# Altium schematic sheet 01_Structure.SchDoc: Board Structure Illustration
size 381 x 266 mm; Organization: Meteroi; Address1: Room 428, 410 Guiping Rd.; Address2: Shanghai 200233, CHINA; SheetNumber: 1; SheetTotal: 9; PageSetup: Record=PageOptions|CenterHorizontal=True|CenterVertical=True|PrintScale=0.75|XCorrection=1.00|YCorrection=1.00|PrintKind=2|BorderSize=5000000|LeftOffset=0|BottomOffset=0|Orientation=2|PaperLength=1000|PaperWidth=1000|Scale=100|PaperSource=276|PrintQuality=-3|MediaType=1|DitherType=10|PaperKind=A4|PrintScaleMode=1
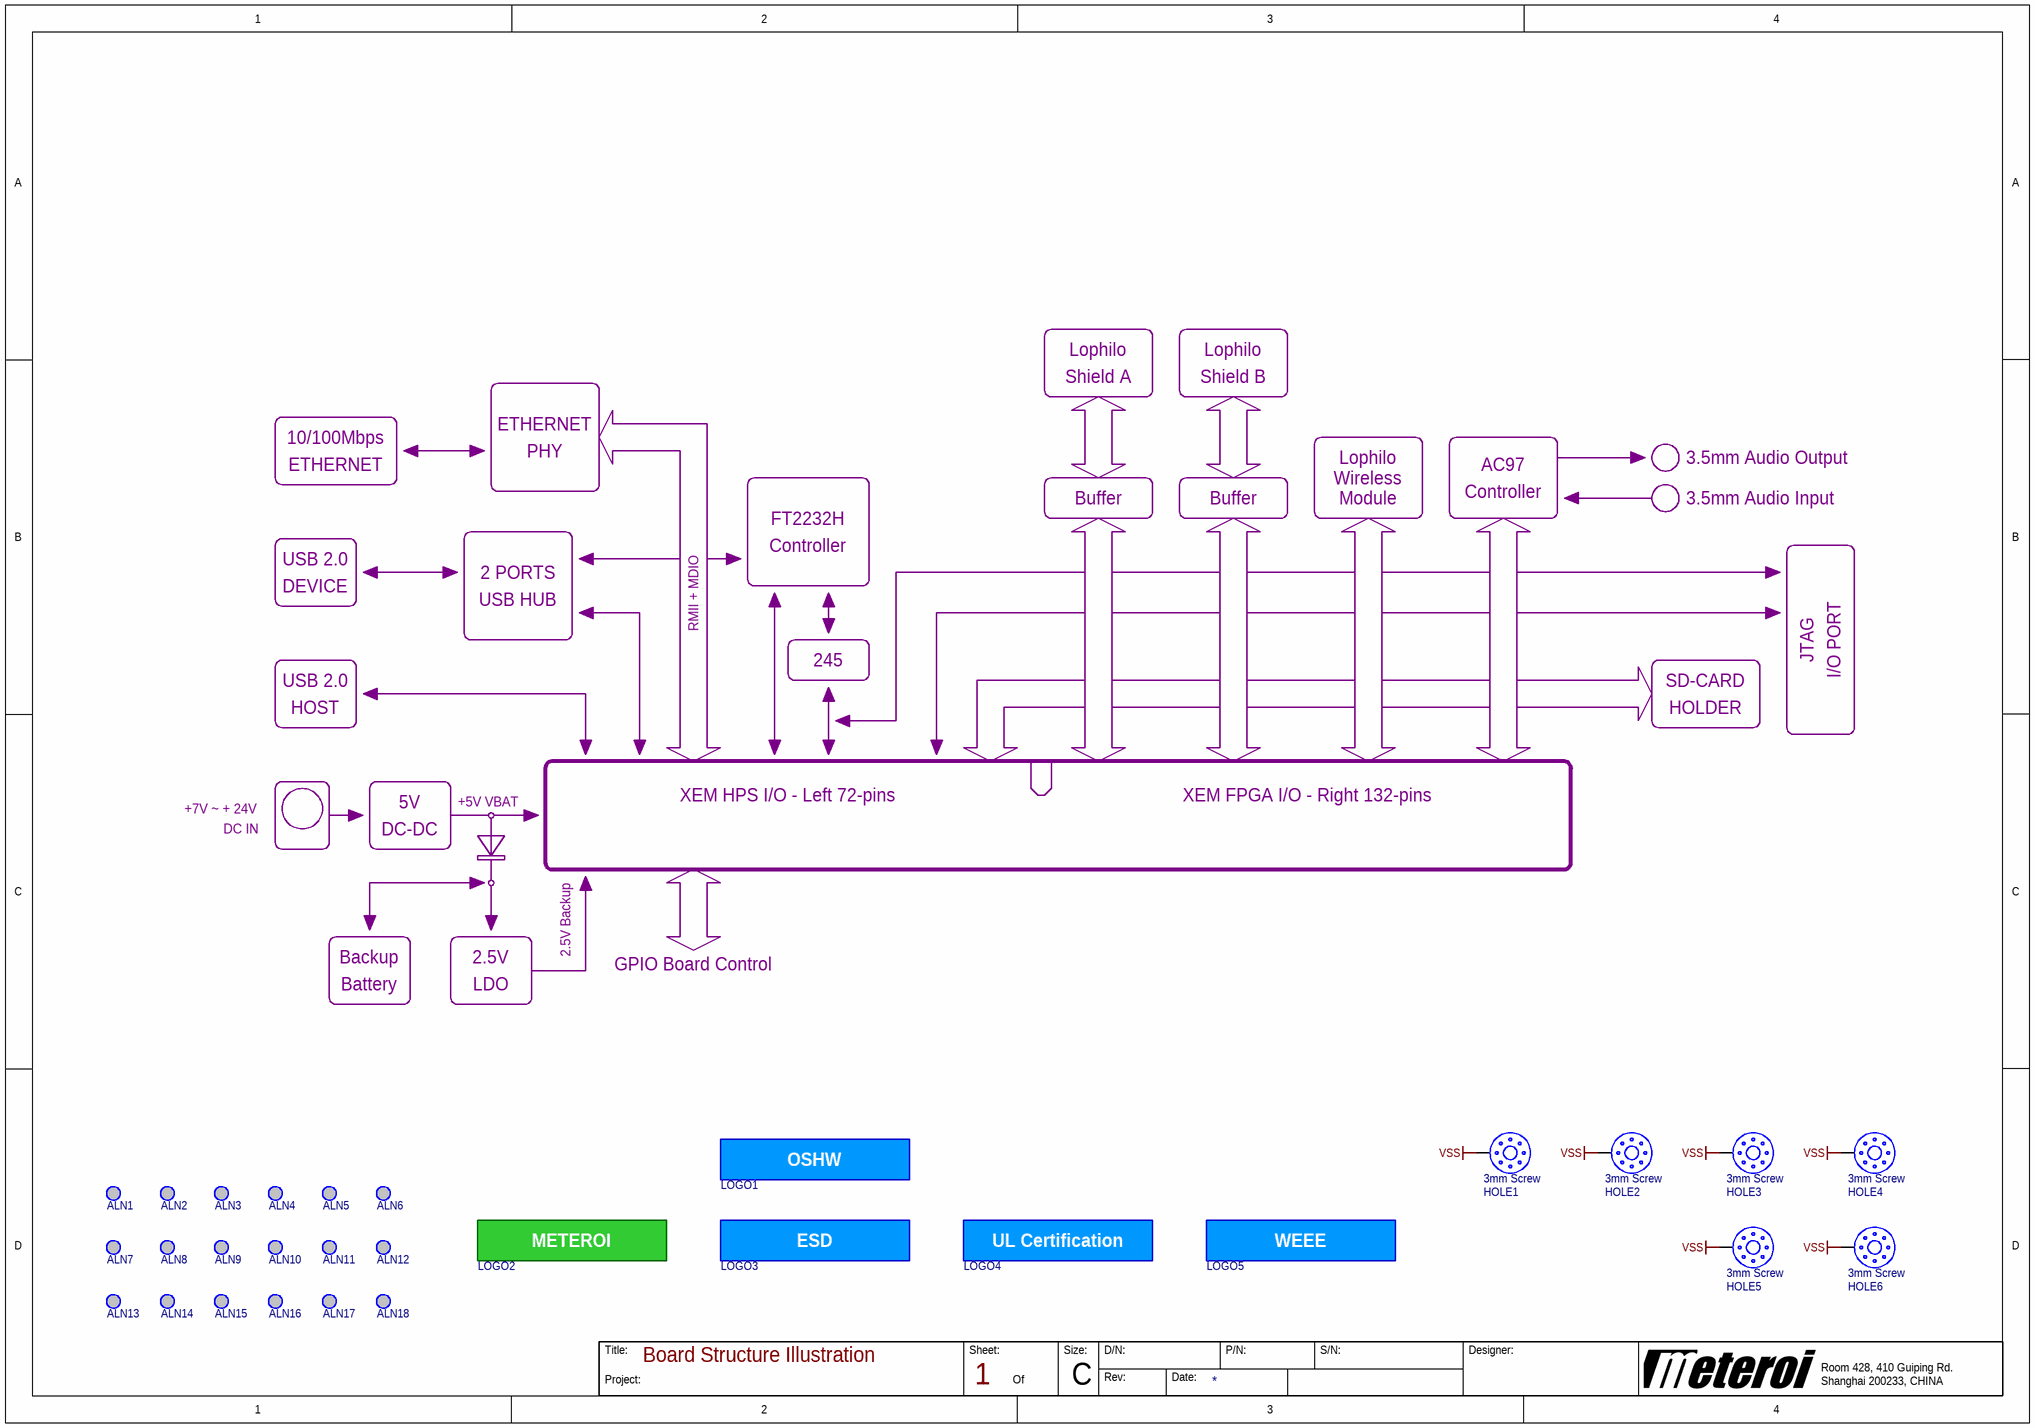
[diagram p0: 01_Structure.SchDoc]

## Parts
ALN1  Assembly Optical Align  [ALIGN_1]  (value not drawn)
ALN2  Assembly Optical Align  [ALIGN_1]  (value not drawn)
ALN3  Assembly Optical Align  [ALIGN_1]  (value not drawn)
ALN4  Assembly Optical Align  [ALIGN_1]  (value not drawn)
ALN5  Assembly Optical Align  [ALIGN_1]  (value not drawn)
ALN6  Assembly Optical Align  [ALIGN_1]  (value not drawn)
ALN7  Assembly Optical Align  [ALIGN_1]  (value not drawn)
ALN8  Assembly Optical Align  [ALIGN_1]  (value not drawn)
ALN9  Assembly Optical Align  [ALIGN_1]  (value not drawn)
ALN10  Assembly Optical Align  [ALIGN_1]  (value not drawn)
ALN11  Assembly Optical Align  [ALIGN_1]  (value not drawn)
ALN12  Assembly Optical Align  [ALIGN_1]  (value not drawn)
ALN13  Assembly Optical Align  [ALIGN_1]  (value not drawn)
ALN14  Assembly Optical Align  [ALIGN_1]  (value not drawn)
ALN15  Assembly Optical Align  [ALIGN_1]  (value not drawn)
ALN16  Assembly Optical Align  [ALIGN_1]  (value not drawn)
ALN17  Assembly Optical Align  [ALIGN_1]  (value not drawn)
ALN18  Assembly Optical Align  [ALIGN_1]  (value not drawn)
HOLE1  3mm Screw  [HOLE_3_S]
HOLE2  3mm Screw  [HOLE_3_S]
HOLE3  3mm Screw  [HOLE_3_S]
HOLE4  3mm Screw  [HOLE_3_S]
HOLE5  3mm Screw  [HOLE_3_S]
HOLE6  3mm Screw  [HOLE_3_S]
LOGO1  OSHW  [LOGO_OSHW_2]  (value not drawn)
LOGO2  LOGO  [LOGO_METEROI_ST_12X3]  (value not drawn)
LOGO3  ESD  [REGULATION_ESD]  (value not drawn)
LOGO4  UL Certification  [REGULATION_PCB_UL]  (value not drawn)
LOGO5  WEEE  [REGULATION_WEEE]  (value not drawn)

## Nets
VSS: HOLE1.1(GND) HOLE2.1(GND) HOLE3.1(GND) HOLE4.1(GND) HOLE5.1(GND) HOLE6.1(GND)

## Notes on the sheet
- Lophilo
- Shield A
- Shield B
- 10/100Mbps
- ETHERNET
- PHY
- Buffer
- Module
- Wireless
- AC97
- Controller
- 3.5mm Audio Output
- 3.5mm Audio Input
- USB 2.0
- 2 PORTS
- FT2232H
- DEVICE
- USB HUB
- RMII + MDIO
- JTAG
- I/O PORT
- HOST
- 245
- SD-CARD
- HOLDER
- +7V ~ + 24V
- DC IN
- 5V
- DC-DC
- +5V VBAT
- XEM HPS I/O - Left 72-pins
- XEM FPGA I/O - Right 132-pins
- Backup
- 2.5V
- 2.5V Backup
- GPIO Board Control
- Battery
- LDO
- Title:
- Project:
- Sheet:
- Of
- Size:
- D/N:
- Rev:
- Date:
- P/N:
- S/N:
- Designer:
- C
- (in symbol LOGO_METEROI) METEROI

## Library data of the parts
ALN1-ALN18 = ALIGN: Vendor: 0; Designer: shyul; PCBMarker: Aligner; Value: Assembly Optical Align; Version: 1.0; VersionDate: 05-21-2011; SerialNumber: 0; PartNumber: 0; Publisher: Cowin
HOLE1-HOLE6 = HOLE: PCB hole for screw installations; Vendor: 0; Designer: shyul; Value: 3mm Screw; Version: 1.0; VersionDate: 05-05-2011; SerialNumber: 0; PartNumber: 0; Publisher: Cowin; PCBMarker: Hole
LOGO1 = REGULATION_OSHW: OSHW Logo; Vendor: 0; Designer: shyul; Value: OSHW; Version: 1.0; VersionDate: 06-02-2012; SerialNumber: 0; PartNumber: 0; Publisher: Cowin; PCBMarker: OSHW
LOGO2 = LOGO_METEROI: Meteroi Logo; Vendor: 0; Designer: shyul; Value: LOGO; Version: 1.0; VersionDate: 05-15-2011; SerialNumber: 0; PartNumber: 0; Publisher: Cowin; PCBMarker: LOGO
LOGO3 = REGULATION_ESD: ESD Logo; Vendor: 0; Designer: shyul; Value: ESD; Version: 1.0; VersionDate: 05-15-2011; SerialNumber: 0; PartNumber: 0; Publisher: Cowin; PCBMarker: ESD
LOGO4 = REGULATION_PCB_UL: PCB UL Certification; Vendor: 0; Designer: shyul; Value: UL Certification; Version: 1.0; VersionDate: 05-15-2011; SerialNumber: 0; PartNumber: 0; Publisher: Cowin; PCBMarker: UL Certification
LOGO5 = REGULATION_WEEE: WEEE Logo; Vendor: 0; Designer: shyul; Value: WEEE; Version: 1.0; VersionDate: 05-15-2011; SerialNumber: 0; PartNumber: 0; Publisher: Cowin; PCBMarker: WEEE